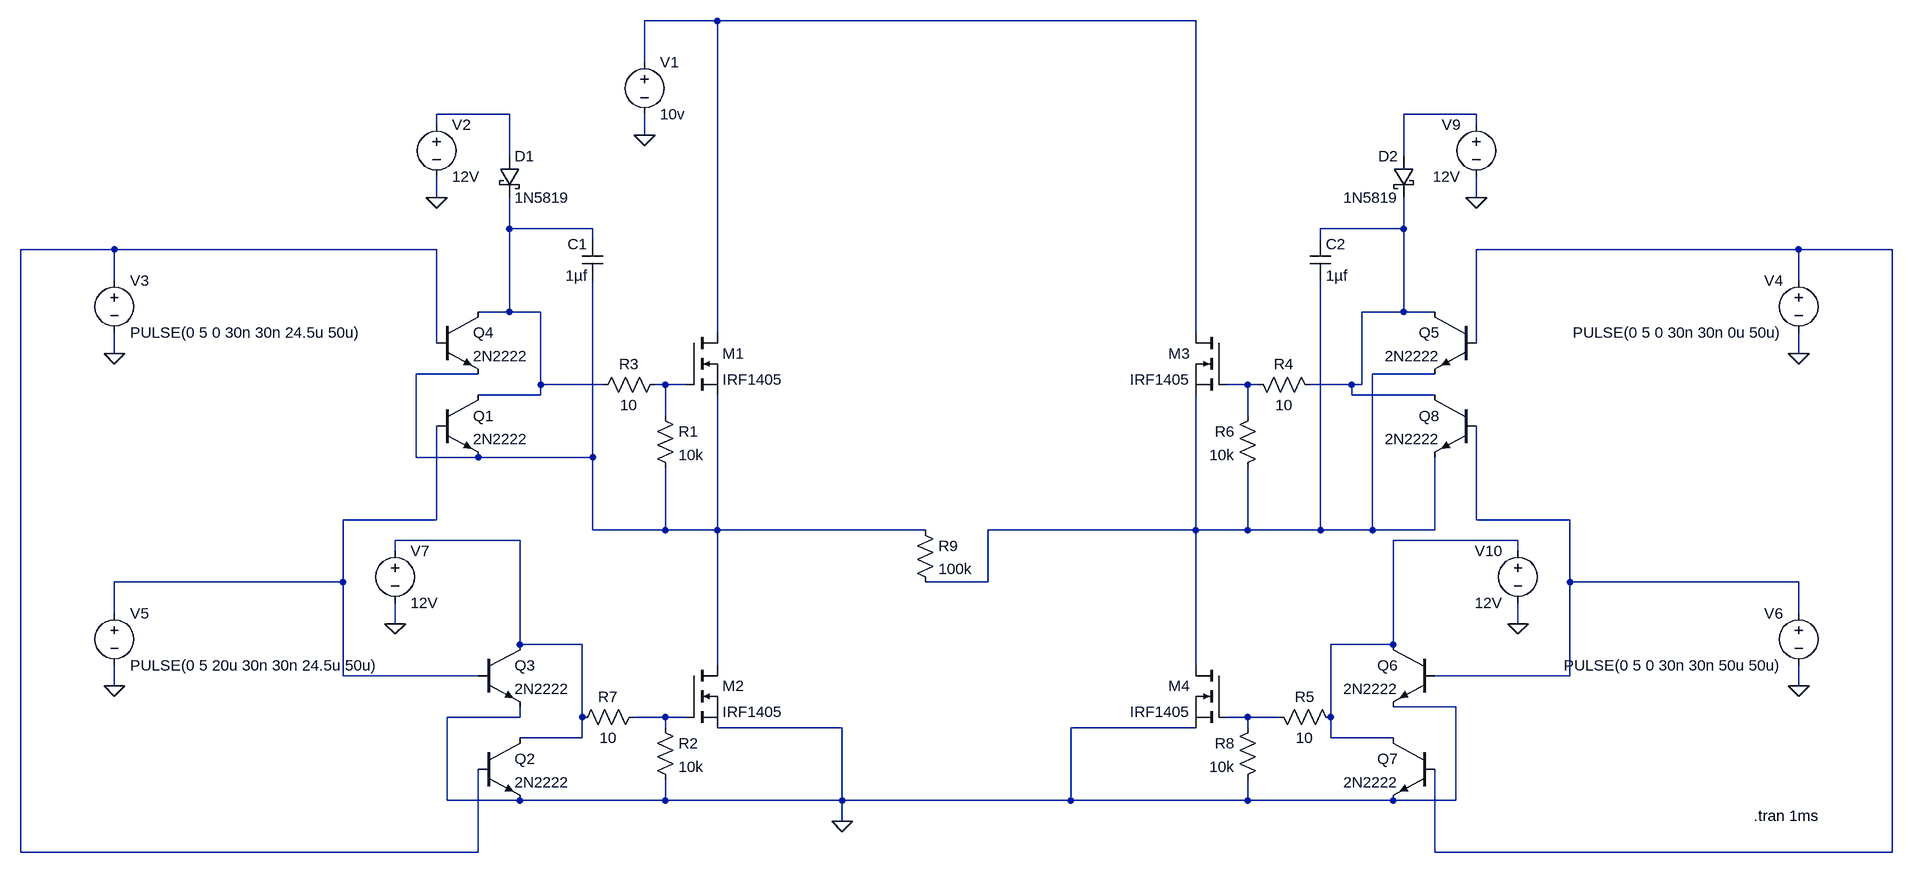
[diagram p0: schematic motor_driver.asc]
motor_driver.asc, the LTspice schematic file:
Version 4.1
SHEET 1 2564 744
WIRE 464 -544 352 -544
WIRE 1200 -544 464 -544
WIRE 352 -480 352 -544
WIRE 144 -400 32 -400
WIRE 1632 -400 1520 -400
WIRE 32 -384 32 -400
WIRE 1632 -384 1632 -400
WIRE 352 -368 352 -400
WIRE 144 -336 144 -400
WIRE 1520 -336 1520 -400
WIRE 32 -272 32 -304
WIRE 1632 -272 1632 -304
WIRE 144 -224 144 -272
WIRE 272 -224 144 -224
WIRE 1520 -224 1520 -272
WIRE 1520 -224 1392 -224
WIRE 272 -208 272 -224
WIRE 1392 -208 1392 -224
WIRE -464 -192 -608 -192
WIRE 32 -192 -464 -192
WIRE 2128 -192 1632 -192
WIRE 2272 -192 2128 -192
WIRE -464 -144 -464 -192
WIRE 2128 -144 2128 -192
WIRE 144 -96 144 -224
WIRE 144 -96 96 -96
WIRE 192 -96 144 -96
WIRE 1520 -96 1520 -224
WIRE 1520 -96 1456 -96
WIRE 1568 -96 1520 -96
WIRE 464 -64 464 -544
WIRE 1200 -64 1200 -544
WIRE 32 -48 32 -192
WIRE 1632 -48 1632 -192
WIRE -464 -32 -464 -64
WIRE 2128 -32 2128 -64
WIRE 96 0 0 0
WIRE 1568 0 1472 0
WIRE 192 16 192 -96
WIRE 288 16 192 16
WIRE 384 16 368 16
WIRE 416 16 384 16
WIRE 1280 16 1248 16
WIRE 1296 16 1280 16
WIRE 1440 16 1376 16
WIRE 1456 16 1456 -96
WIRE 1456 16 1440 16
WIRE 192 32 192 16
WIRE 192 32 96 32
WIRE 1440 32 1440 16
WIRE 1568 32 1440 32
WIRE 384 64 384 16
WIRE 1280 64 1280 16
WIRE 0 128 0 0
WIRE 96 128 0 128
WIRE 272 128 272 -144
WIRE 272 128 96 128
WIRE 32 224 32 80
WIRE 32 224 -112 224
WIRE 1632 224 1632 80
WIRE 1776 224 1632 224
WIRE 272 240 272 128
WIRE 384 240 384 144
WIRE 384 240 272 240
WIRE 464 240 464 32
WIRE 464 240 384 240
WIRE 784 240 464 240
WIRE 1200 240 1200 32
WIRE 1200 240 880 240
WIRE 1280 240 1280 144
WIRE 1280 240 1200 240
WIRE 1392 240 1392 -144
WIRE 1392 240 1280 240
WIRE 1472 240 1472 0
WIRE 1472 240 1392 240
WIRE 1568 240 1568 128
WIRE 1568 240 1472 240
WIRE 160 256 -32 256
WIRE 1696 256 1504 256
WIRE -32 272 -32 256
WIRE 1696 272 1696 256
WIRE -112 320 -112 224
WIRE -112 320 -464 320
WIRE 880 320 880 240
WIRE 880 320 784 320
WIRE 1776 320 1776 224
WIRE 2128 320 1776 320
WIRE -464 368 -464 320
WIRE 2128 368 2128 320
WIRE -32 384 -32 352
WIRE 1696 384 1696 352
WIRE 160 416 160 256
WIRE 256 416 160 416
WIRE 1504 416 1504 256
WIRE 1504 416 1408 416
WIRE 464 448 464 240
WIRE 1200 448 1200 240
WIRE -112 464 -112 320
WIRE 96 464 -112 464
WIRE 1776 464 1776 320
WIRE 1776 464 1568 464
WIRE -464 480 -464 448
WIRE 2128 480 2128 448
WIRE 1600 512 1504 512
WIRE 160 528 160 512
WIRE 160 528 48 528
WIRE 256 528 256 416
WIRE 384 528 336 528
WIRE 416 528 384 528
WIRE 1280 528 1248 528
WIRE 1328 528 1280 528
WIRE 1408 528 1408 416
WIRE 384 544 384 528
WIRE 656 544 464 544
WIRE 1200 544 1008 544
WIRE 1280 544 1280 528
WIRE 256 560 256 528
WIRE 256 560 160 560
WIRE 1408 560 1408 528
WIRE 1504 560 1408 560
WIRE 48 656 48 528
WIRE 160 656 48 656
WIRE 384 656 384 624
WIRE 384 656 160 656
WIRE 656 656 656 544
WIRE 656 656 384 656
WIRE 1008 656 1008 544
WIRE 1008 656 656 656
WIRE 1280 656 1280 624
WIRE 1280 656 1008 656
WIRE 1504 656 1280 656
WIRE 1600 656 1600 512
WIRE 1600 656 1504 656
WIRE 656 688 656 656
WIRE -608 736 -608 -192
WIRE 96 736 96 608
WIRE 96 736 -608 736
WIRE 1568 736 1568 608
WIRE 2272 736 2272 -192
WIRE 2272 736 1568 736
FLAG -464 -32 0
FLAG -464 480 0
FLAG 352 -368 0
FLAG 32 -272 0
FLAG -32 384 0
FLAG 656 688 0
FLAG 2128 -32 0
FLAG 2128 480 0
FLAG 1632 -272 0
FLAG 1696 384 0
SYMBOL nmos 416 -64 R0
SYMATTR InstName M1
SYMATTR Value IRF1405
SYMBOL npn 32 -96 R0
SYMATTR InstName Q4
SYMATTR Value 2N2222
SYMBOL voltage -464 -160 R0
WINDOW 123 0 0 Left 0
WINDOW 39 0 0 Left 0
SYMATTR InstName V3
SYMATTR Value PULSE(0 5 0 30n 30n 24.5u 50u)
SYMBOL nmos 416 448 R0
SYMATTR InstName M2
SYMATTR Value IRF1405
SYMBOL npn 96 416 R0
SYMATTR InstName Q3
SYMATTR Value 2N2222
SYMBOL schottky 128 -336 R0
SYMATTR InstName D1
SYMATTR Value 1N5819
SYMATTR Description Diode
SYMATTR Type diode
SYMBOL res 384 0 R90
WINDOW 0 0 56 VBottom 2
WINDOW 3 32 56 VTop 2
SYMATTR InstName R3
SYMATTR Value 10
SYMBOL cap 288 -208 M0
SYMATTR Value 1µf
SYMATTR InstName C1
SYMATTR SpiceLine V=16 Irms=0 Rser=11 Lser=0 mfg="AVX" pn="TAJA105K016" type="Tantalum"
SYMBOL voltage -464 352 R0
WINDOW 123 0 0 Left 0
WINDOW 39 0 0 Left 0
SYMATTR InstName V5
SYMATTR Value PULSE(0 5 20u 30n 30n 24.5u 50u)
SYMBOL res 352 512 R90
WINDOW 0 0 56 VBottom 2
WINDOW 3 32 56 VTop 2
SYMATTR InstName R7
SYMATTR Value 10
SYMBOL voltage 352 -496 R0
WINDOW 123 0 0 Left 0
WINDOW 39 0 0 Left 0
SYMATTR InstName V1
SYMATTR Value 10v
SYMBOL voltage 32 -400 R0
WINDOW 123 0 0 Left 0
WINDOW 39 0 0 Left 0
SYMATTR InstName V2
SYMATTR Value 12V
SYMBOL voltage -32 256 R0
WINDOW 123 0 0 Left 0
WINDOW 39 0 0 Left 0
SYMATTR InstName V7
SYMATTR Value 12V
SYMBOL npn 96 560 R0
SYMATTR InstName Q2
SYMATTR Value 2N2222
SYMBOL npn 32 32 R0
SYMATTR InstName Q1
SYMATTR Value 2N2222
SYMBOL res 368 48 R0
SYMATTR InstName R1
SYMATTR Value 10k
SYMBOL res 368 528 R0
SYMATTR InstName R2
SYMATTR Value 10k
SYMBOL nmos 1248 -64 M0
SYMATTR InstName M3
SYMATTR Value IRF1405
SYMBOL npn 1632 -96 M0
SYMATTR InstName Q5
SYMATTR Value 2N2222
SYMBOL voltage 2128 -160 M0
WINDOW 123 0 0 Left 0
WINDOW 39 0 0 Left 0
SYMATTR InstName V4
SYMATTR Value PULSE(0 5 0 30n 30n 0u 50u)
SYMBOL nmos 1248 448 M0
SYMATTR InstName M4
SYMATTR Value IRF1405
SYMBOL npn 1568 416 M0
SYMATTR InstName Q6
SYMATTR Value 2N2222
SYMBOL schottky 1536 -336 M0
SYMATTR InstName D2
SYMATTR Value 1N5819
SYMATTR Description Diode
SYMATTR Type diode
SYMBOL res 1280 0 M90
WINDOW 0 0 56 VBottom 2
WINDOW 3 32 56 VTop 2
SYMATTR InstName R4
SYMATTR Value 10
SYMBOL cap 1376 -208 R0
SYMATTR Value 1µf
SYMATTR InstName C2
SYMATTR SpiceLine V=16 Irms=0 Rser=11 Lser=0 mfg="AVX" pn="TAJA105K016" type="Tantalum"
SYMBOL voltage 2128 352 M0
WINDOW 123 0 0 Left 0
WINDOW 39 0 0 Left 0
SYMATTR InstName V6
SYMATTR Value PULSE(0 5 0 30n 30n 50u 50u)
SYMBOL res 1312 512 M90
WINDOW 0 0 56 VBottom 2
WINDOW 3 32 56 VTop 2
SYMATTR InstName R5
SYMATTR Value 10
SYMBOL voltage 1632 -400 M0
WINDOW 123 0 0 Left 0
WINDOW 39 0 0 Left 0
SYMATTR InstName V9
SYMATTR Value 12V
SYMBOL voltage 1696 256 M0
WINDOW 123 0 0 Left 0
WINDOW 39 0 0 Left 0
SYMATTR InstName V10
SYMATTR Value 12V
SYMBOL npn 1568 560 M0
SYMATTR InstName Q7
SYMATTR Value 2N2222
SYMBOL npn 1632 32 M0
SYMATTR InstName Q8
SYMATTR Value 2N2222
SYMBOL res 1296 48 M0
SYMATTR InstName R6
SYMATTR Value 10k
SYMBOL res 1296 528 M0
SYMATTR InstName R8
SYMATTR Value 10k
SYMBOL res 768 224 R0
SYMATTR InstName R9
SYMATTR Value 100k
TEXT 2160 680 Right 2 !.tran 1ms

The netlist it stands for:
* motor_driver.asc
M1 N001 N010 N008 N008 IRF1405
Q4 N004 N006 N008 0 2N2222
V3 N006 0 PULSE(0 5 0 30n 30n 24.5u 50u)
M2 N008 N016 0 0 IRF1405
Q3 N014 N012 0 0 2N2222
D1 N002 N004 1N5819
R3 N010 N004 10
C1 N004 N008 1µf V=16 Irms=0 Rser=11 Lser=0 mfg="AVX" pn="TAJA105K016" type="Tantalum"
V5 N012 0 PULSE(0 5 20u 30n 30n 24.5u 50u)
R7 N016 N014 10
V1 N001 0 10v
V2 N002 0 12V
V7 N014 0 12V
Q2 N014 N006 0 0 2N2222
Q1 N004 N012 N008 0 2N2222
R1 N010 N008 10k
R2 N016 0 10k
M3 N001 N011 N009 N009 IRF1405
Q5 N005 N007 N009 0 2N2222
V4 N007 0 PULSE(0 5 0 30n 30n 0u 50u)
M4 N009 N017 0 0 IRF1405
Q6 N015 N013 0 0 2N2222
D2 N003 N005 1N5819
R4 N011 N005 10
C2 N005 N009 1µf V=16 Irms=0 Rser=11 Lser=0 mfg="AVX" pn="TAJA105K016" type="Tantalum"
V6 N013 0 PULSE(0 5 0 30n 30n 50u 50u)
R5 N017 N015 10
V9 N003 0 12V
V10 N015 0 12V
Q7 N015 N007 0 0 2N2222
Q8 N005 N013 N009 0 2N2222
R6 N011 N009 10k
R8 N017 0 10k
R9 N008 N009 100k
.model D D
.lib standard.dio
.model NPN NPN
.model PNP PNP
.lib standard.bjt
.model NMOS NMOS
.model PMOS PMOS
.lib standard.mos
.tran 1ms
.backanno
.end